# Altium schematic sheet Main.SchDoc
size 228 x 88 mm
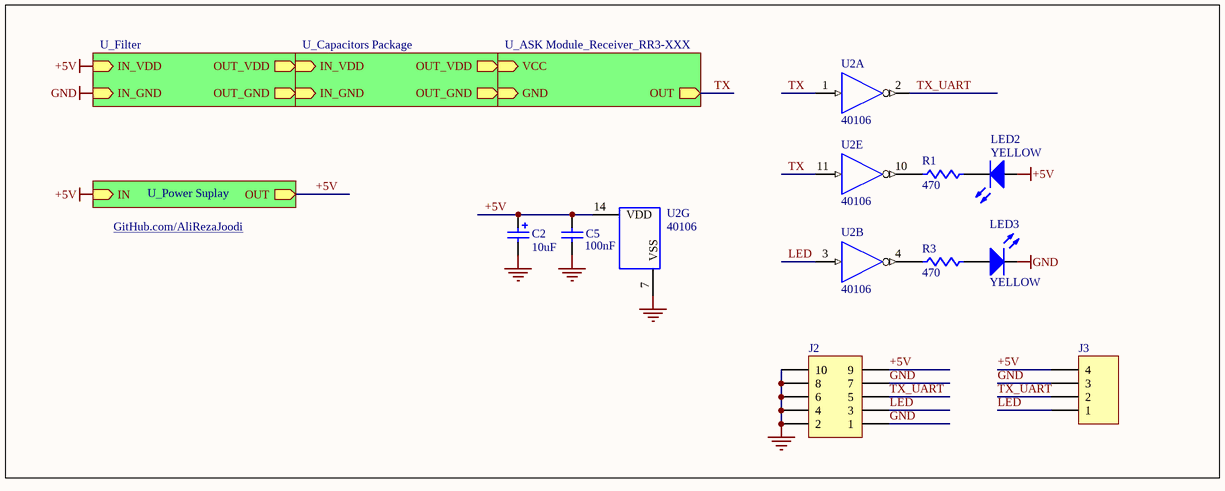
[diagram p0: Main.SchDoc]

## Parts
C2  10uF  [CAPPR2.5-6.3x5]
C5  100nF  [CAPNTO2.54-3.05x1.78A]
J2  Header 5X2  [FKV10SN]  (value not drawn)
J3  3PIN  [HDR1X4]  (value not drawn)
LED2  YELLOW  [LED-5mm_Red]
LED3  YELLOW  [LED-5mm_Red]
R1  470  [AXIAL-0.4]
R3  470  [AXIAL-0.4]
U2  40106  [DIP14]  (parts A,B,E,G of 7)

## Sub-sheets
U_ASK Module_Receiver_RR3-XXX = ASK Module_Receiver_RR3-XXX.SchDoc: VCC (in), GND (in), OUT (out)
U_Capacitors Package = Capacitors Package.SchDoc: IN_VDD (in), IN_GND (in), OUT_VDD (out), OUT_GND (out)
U_Filter = Filter.SchDoc: IN_VDD (in), IN_GND (in), OUT_VDD (out), OUT_GND (out)
U_Power Suplay = Power Suplay.SchDoc: IN (in), OUT (out)

## Nets
+5V: C2.1 C5.2 J2.9 J3.4 LED2.1(A) U2.14(VDD) ; sheet U_Filter/IN_VDD, sheet U_Power Suplay/IN, sheet U_Power Suplay/OUT
GND: C2.2 C5.1 J2.1 J2.2 J2.4 J2.6 J2.7 J2.8 J2.10 J3.3 LED3.2(K) U2.7(VSS) ; sheet U_Filter/IN_GND
LED: J2.3 J3.1 U2.3(I)
TX: U2.1(I) U2.11(I) ; sheet U_ASK Module_Receiver_RR3-XXX/OUT
TX_UART: J2.5 J3.2 U2.2(~{O})
NetLED2_2: LED2.2(K) R1.2
NetLED3_1: LED3.1(A) R3.2
NetR1_1: R1.1 U2.10(~{O})
NetR3_1: R3.1 U2.4(~{O})
(unnamed): sheet U_Filter/OUT_VDD, sheet U_Capacitors Package/IN_VDD
(unnamed): sheet U_Filter/OUT_GND, sheet U_Capacitors Package/IN_GND
(unnamed): sheet U_Capacitors Package/OUT_VDD, sheet U_ASK Module_Receiver_RR3-XXX/VCC
(unnamed): sheet U_Capacitors Package/OUT_GND, sheet U_ASK Module_Receiver_RR3-XXX/GND

## Notes on the sheet
- GitHub.com/AliRezaJoodi

## Library data of the parts
C2 = Cap Pol1: Polarized Capacitor (Radial); Manufacturer: Generic Components; Class I: Passive; Published: 8-Jun-2000; Revision: July-2002: Re-released for DXP Platform.; Publisher: Altium Limited; Class II: Capacitor
C5 = Cap: Capacitor; Manufacturer: Generic Components; Class I: Passive; Published: 8-Jun-2000; Revision: July-2002: Re-released for DXP Platform.; Publisher: Altium Limited; Class II: Capacitor; Value: 100nF
J2 = Header 5X2: Header, 5-Pin, Dual row; Manufacturer: Generic Components; Class I: Connector; Revision: July-2002: Re-released for DXP Platform.; Publisher: Altium Limited
J3 = Header 4: Header, 4-Pin; Manufacturer: Generic Components; Class I: Connector; Revision: July-2002: Re-released for DXP Platform.; Publisher: Altium Limited
LED2 LED3 = LED: Typical INFRARED GaAs LED; Manufacturer: Generic Components; Class I: Optoelectronic; Published: 8-Jun-2000; Revision: July-2002: Re-released for DXP Platform.; Publisher: Altium Limited; Class II: LED
R1 R3 = Res1: Resistor; Manufacturer: Generic Components; Class I: Passive; Published: 8-Jun-2000; Revision: July-2002: Re-released for DXP Platform.; Publisher: Altium Limited; Class II: Resistor
U2 = 40106: Hex inverting Schmitt trigger, 14-Pin; Publisher: Altium Limited; ComponentLink1URL: http://www.nxp.com